# Altium project Carrier_Board.PrjPcb (part 2 of 2)

## Sheet Connectors.SchDoc
size A3; SheetNumber: 3; SheetTotal: 9
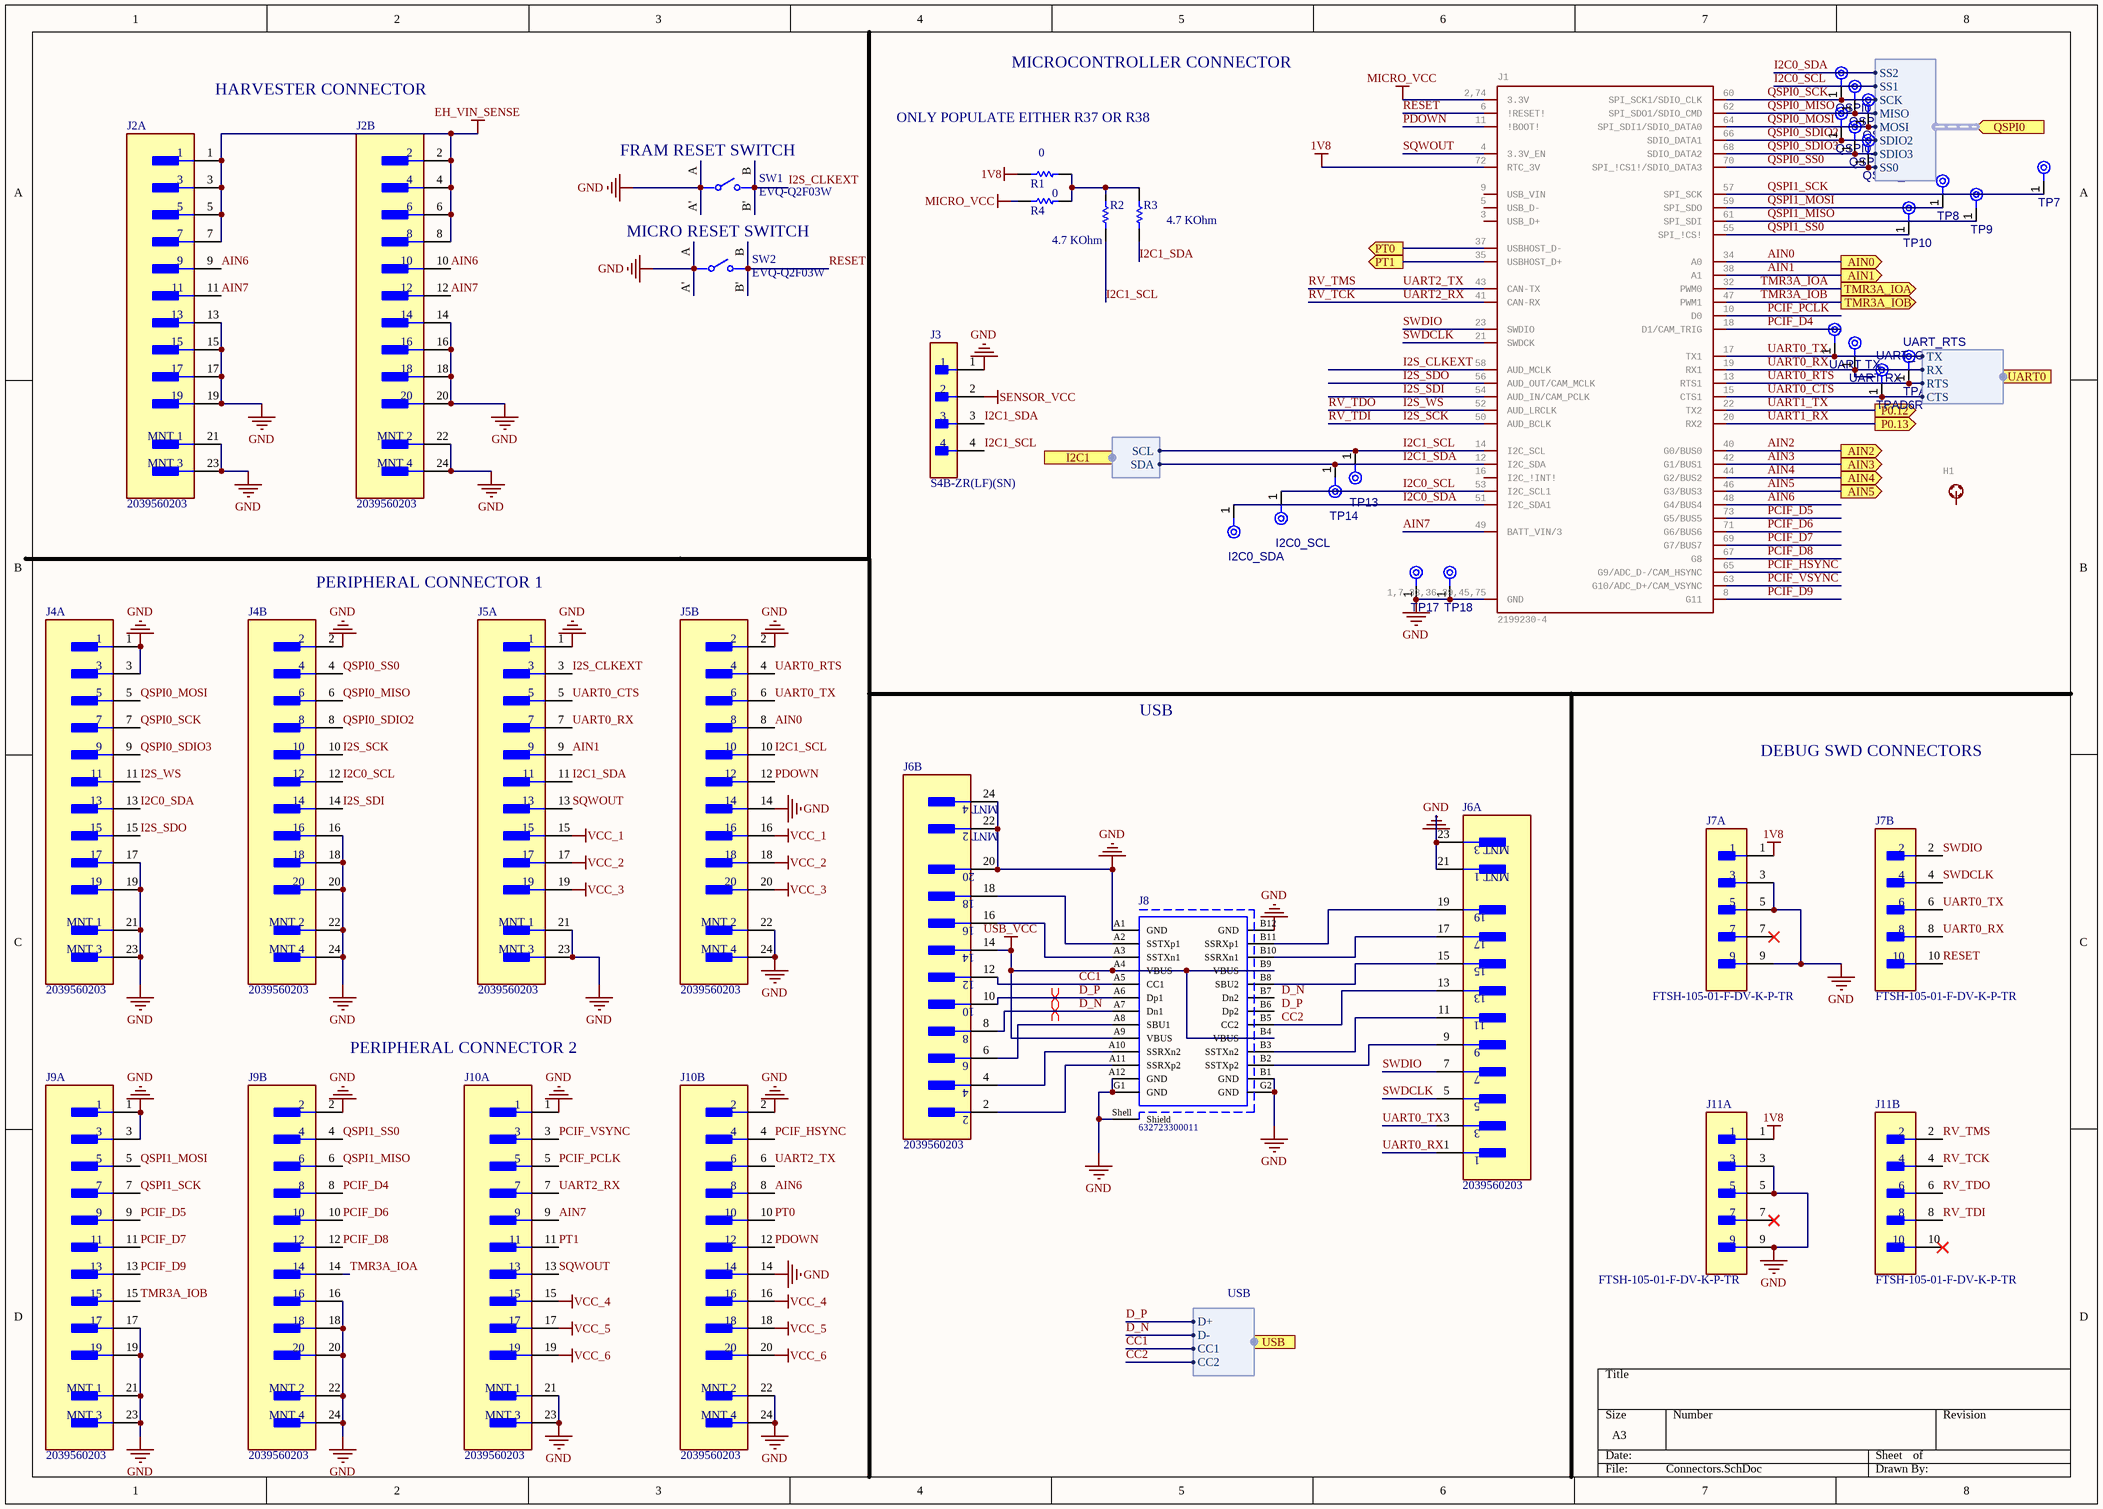
[diagram p4: Connectors.SchDoc]

### Parts
H1  9774025151R  [STAND-OFF-REFLOW-M2-5]  (value not drawn)
I2C0_SCL  TPAD6R  [TP06R]  (value not drawn)  (no BOM)
I2C0_SDA  TPAD6R  [TP06R]  (value not drawn)  (no BOM)
J1  2199230-4  [M-2-CONNECTOR-E]
J2  2039560203  [Molex_0_MFG]  (parts A,B of 2)
J3  S4B-ZR(LF)(SN)  [FP-S4B-ZR_LF_SN-MFG]
J4  2039560203  [Molex_0_MFG]  (parts A,B of 2)
J5  2039560203  [Molex_0_MFG]  (parts A,B of 2)
J6  2039560203  [Molex_0_MFG]  (parts A,B of 2)
J7  FTSH-105-01-F-DV-K-P-TR  [FP-FTSH-105-01-F-DV-K-P-T-MFG]  (parts A,B of 2)
J8  632723300011  [632723300011]
J9  2039560203  [Molex_0_MFG]  (parts A,B of 2)
J10  2039560203  [Molex_0_MFG]  (parts A,B of 2)
J11  FTSH-105-01-F-DV-K-P-TR  [FP-FTSH-105-01-F-DV-K-P-T-MFG]  (parts A,B of 2)
QSPI0_MISO  TPAD6R  [TP06R]  (value not drawn)  (no BOM)
QSPI0_MOSI  TPAD6R  [TP06R]  (value not drawn)  (no BOM)
QSPI0_SCK  TPAD6R  [TP06R]  (value not drawn)  (no BOM)
QSPI0_SDIO2  TPAD6R  [TP06R]  (value not drawn)  (no BOM)
QSPI0_SDIO3  TPAD6R  [TP06R]  (value not drawn)  (no BOM)
QSPI0_SS0  TPAD6R  [TP06R]  (value not drawn)  (no BOM)
R1  Resistance: 0  [RESC1005X40X25NL05T10]  (hidden comment: RC0402JR-070RL)
R2  Resistance: 4.7 KOhm  [RESC1005X40X25ML05T05]  (hidden comment: RMCF0402JT4K70)
R3  Resistance: 4.7 KOhm  [RESC1005X40X25ML05T05]  (hidden comment: RMCF0402JT4K70)
R4  Resistance: 0  [RESC1005X40X25NL05T10]  (hidden comment: RC0402JR-070RL)
SW1  EVQ-Q2F03W  [FP-EVQ-Q2F03W-MFG]
SW2  EVQ-Q2F03W  [FP-EVQ-Q2F03W-MFG]
TP7  TPAD6R  [TP06R]  (value not drawn)  (no BOM)
TP8  TPAD6R  [TP06R]  (value not drawn)  (no BOM)
TP9  TPAD6R  [TP06R]  (value not drawn)  (no BOM)
TP10  TPAD6R  [TP06R]  (value not drawn)  (no BOM)
TP13  TPAD6R  [TP06R]  (value not drawn)  (no BOM)
TP14  TPAD6R  [TP06R]  (value not drawn)  (no BOM)
TP17  TPAD6R  [TP06R]  (value not drawn)  (no BOM)
TP18  TPAD6R  [TP06R]  (value not drawn)  (no BOM)
UART_CTS  TPAD6R  [TP06R]  (no BOM)
UART_RTS  TPAD6R  [TP06R]  (no BOM)
UART_RX  TPAD6R  [TP06R]  (value not drawn)  (no BOM)
UART_TX  TPAD6R  [TP06R]  (value not drawn)  (no BOM)

### Ports
AIN0 (out), AIN1 (out), AIN2 (out), AIN3 (out), AIN4 (out), AIN5 (out), I2C1 (in, harness I2C1), P0.12 (out), P0.13 (out), PT0 (out), PT1 (out), QSPI0 (in, harness QSPI0), TMR3A_IOA (out), TMR3A_IOB (out), UART0 (out, harness *), USB (out, harness USB)

### Harnesses
QSPI0: SCK, MISO, MOSI, SDIO2, SDIO3, SS0, SS1, SS2
I2C1: SCL, SDA
*: TX, RX, RTS, CTS
USB: D+, D-, CC1, CC2

### Nets
1V8: J1.72(RTC_3V) J7.1 J11.1 R1.1
EH_VIN_SENSE: J2.1 J2.2 J2.3 J2.4 J2.5 J2.6 J2.7 J2.8
GND: J1.1,7,33,36,39,45,75(GND) J2.13 J2.14 J2.15 J2.16 J2.17 J2.18 J2.19 J2.20 J2.21(MNT_1) J2.22(MNT_2) J2.23(MNT_3) J2.24(MNT_4) J3.1 J4.1 J4.2 J4.3 J4.16 J4.17 J4.18 J4.19 J4.20 J4.21(MNT_1) J4.22(MNT_2) J4.23(MNT_3) J4.24(MNT_4) J5.1 J5.2 J5.14 J5.21(MNT_1) J5.22(MNT_2) J5.23(MNT_3) J5.24(MNT_4) J6.20 J6.21(MNT_1) J6.22(MNT_2) J6.23(MNT_3) J6.24(MNT_4) J7.3 J7.5 J7.9 J8.A1(GND) J8.A12(GND) J8.B1(GND) J8.B12(GND) J8.G1(GND) J8.G2(GND) J8.Shell(Shield) J9.1 J9.2 J9.3 J9.16 J9.17 J9.18 J9.19 J9.20 J9.21(MNT_1) J9.22(MNT_2) J9.23(MNT_3) J9.24(MNT_4) J10.1 J10.2 J10.14 J10.21(MNT_1) J10.22(MNT_2) J10.23(MNT_3) J10.24(MNT_4) J11.3 J11.5 J11.9 SW1.A SW1.A' SW2.A SW2.A' TP17.1(TP) TP18.1(TP)
MICRO_VCC: J1.2,74(3.3V) R4.1
SENSOR_VCC: J3.2
USB_VCC: J6.14 J8.A4(VBUS) J8.A9(VBUS) J8.B4(VBUS) J8.B9(VBUS)
VCC_1: J5.15 J5.16
VCC_2: J5.17 J5.18
VCC_3: J5.19 J5.20
VCC_4: J10.15 J10.16
VCC_5: J10.17 J10.18
VCC_6: J10.19 J10.20
AIN0: J1.34(A0) J5.8 ; port AIN0
AIN1: J1.38(A1) J5.9 ; port AIN1
AIN2: J1.40(G0/BUS0) ; port AIN2  [project net ADC0]
AIN3: J1.42(G1/BUS1) ; port AIN3  [project net ADC1]
AIN4: J1.44(G2/BUS2) ; port AIN4  [project net ADC2]
AIN5: J1.46(G3/BUS3) ; port AIN5
AIN6: J1.48(G4/BUS4) J2.9 J2.10 J10.8
AIN7: J1.49(BATT_VIN/3) J2.11 J2.12 J10.9
CC1: J6.12 J8.A5(CC1) ; port USB.CC1
CC2: J6.13 J8.B5(CC2) ; port USB.CC2
D_N: J6.8 J8.A7(Dn1) ; port USB.D-
D_P: J6.10 J8.A6(Dp1) ; port USB.D+
I2C0_SCL: I2C0_SCL.1(TP) J1.53(I2C_SCL1) J4.12 ; port QSPI0.SS1
I2C0_SDA: I2C0_SDA.1(TP) J1.51(I2C_SDA1) J4.13 ; port QSPI0.SS2
I2C1_SCL: J1.14(I2C_SCL) J3.4 J5.10 R2.1 TP13.1(TP) ; port I2C1.SCL
I2C1_SDA: J1.12(I2C_SDA) J3.3 J5.11 R3.1 TP14.1(TP) ; port I2C1.SDA
I2S_CLKEXT: J1.58(AUD_MCLK) J5.3 SW1.B SW1.B'
I2S_SCK: J1.50(AUD_BCLK) J4.10 J11.8  [also labelled RV_TDI]
I2S_SDI: J1.54(AUD_IN/CAM_PCLK) J4.14
I2S_SDO: J1.56(AUD_OUT/CAM_MCLK) J4.15
I2S_WS: J1.52(AUD_LRCLK) J4.11 J11.6  [also labelled RV_TDO]
PCIF_D4: J1.18(D1/CAM_TRIG) J9.8
PCIF_D5: J1.73(G5/BUS5) J9.9
PCIF_D6: J1.71(G6/BUS6) J9.10
PCIF_D7: J1.69(G7/BUS7) J9.11
PCIF_D8: J1.67(G8) J9.12
PCIF_D9: J1.8(G11) J9.13
PCIF_HSYNC: J1.65(G9/ADC_D-/CAM_HSYNC) J10.4
PCIF_PCLK: J1.10(D0) J10.5
PCIF_VSYNC: J1.63(G10/ADC_D+/CAM_VSYNC) J10.3
PDOWN: J1.11(!BOOT!) J5.12 J10.12
PT0: J10.10
PT1: J10.11
QSPI0_MISO: J1.62(SPI_SDO1/SDIO_CMD) J4.6 QSPI0_MISO.1(TP) ; port QSPI0.MISO
QSPI0_MOSI: J1.64(SPI_SDI1/SDIO_DATA0) J4.5 QSPI0_MOSI.1(TP) ; port QSPI0.MOSI
QSPI0_SCK: J1.60(SPI_SCK1/SDIO_CLK) J4.7 QSPI0_SCK.1(TP) ; port QSPI0.SCK
QSPI0_SDIO2: J1.66(SDIO_DATA1) J4.8 QSPI0_SDIO2.1(TP) ; port QSPI0.SDIO2
QSPI0_SDIO3: J1.68(SDIO_DATA2) J4.9 QSPI0_SDIO3.1(TP) ; port QSPI0.SDIO3
QSPI0_SS0: J1.70(SPI_!CS1!/SDIO_DATA3) J4.4 QSPI0_SS0.1(TP) ; port QSPI0.SS0
QSPI1_MISO: J1.61(SPI_SDI) J9.6 TP9.1(TP)
QSPI1_MOSI: J1.59(SPI_SDO) J9.5 TP8.1(TP)
QSPI1_SCK: J1.57(SPI_SCK) J9.7 TP7.1(TP)
QSPI1_SS0: J1.55(SPI_!CS!) J9.4 TP10.1(TP)
RCLK: J1.35(USBHOST_D+) ; port PT1
RESET: J1.6(!RESET!) J7.10 SW2.B SW2.B'
RV_TCK: J1.41(CAN-RX) J10.7 J11.4  [also labelled UART2_RX]
RV_TMS: J1.43(CAN-TX) J10.6 J11.2  [also labelled UART2_TX]
SQWOUT: J1.4(3.3V_EN) J5.13 J10.13
SRCLK: J1.37(USBHOST_D-) ; port PT0
SWDCLK: J1.21(SWDCK) J6.5 J7.4
SWDIO: J1.23(SWDIO) J6.7 J7.2
TMR3A_IOA: J1.32(PWM0) J9.14 ; port TMR3A_IOA  [project net CASCADE_EN]
TMR3A_IOB: J1.47(PWM1) J9.15 ; port TMR3A_IOB
UART0_CTS: J1.15(CTS1) J5.5 UART_CTS.1(TP) ; port UART0.CTS
UART0_RTS: J1.13(RTS1) J5.4 UART_RTS.1(TP) ; port UART0.RTS
UART0_RX: J1.19(RX1) J5.7 J6.1 J7.8 UART_RX.1(TP) ; port UART0.RX
UART0_TX: J1.17(TX1) J5.6 J6.3 J7.6 UART_TX.1(TP) ; port UART0.TX
UART1_RX: J1.20(RX2) ; port P0.13  [project net CLK]
UART1_TX: J1.22(TX2) ; port P0.12  [project net SHIFT_DATA]
NetJ6_2: J6.2 J8.A11(SSRXp2)
NetJ6_4: J6.4 J8.A10(SSRXn2)
NetJ6_6: J6.6 J8.A8(SBU1)
NetJ6_9: J6.9 J8.B2(SSTXp2)
NetJ6_11: J6.11 J8.B3(SSTXn2)
NetJ6_15: J6.15 J8.B8(SBU2)
NetJ6_16: J6.16 J8.A3(SSTXn1)
NetJ6_17: J6.17 J8.B10(SSRXn1)
NetJ6_18: J6.18 J8.A2(SSTXp1)
NetJ6_19: J6.19 J8.B11(SSRXp1)
NetR1_2: R1.2 R2.2 R3.2 R4.2

Not connected (* = marked no-connect by the designer): H1 1; J1 3(USB_D+) 5(USB_D-) 9(USB_VIN) 16(I2C_!INT!); J7 7*; J8 B6(Dp2) B7(Dn2); J11 7* 10*

### Layout directives
differential pair: D_N, D_P

### Notes on the sheet
- HARVESTER CONNECTOR
- MICROCONTROLLER CONNECTOR
- (near SW1) FRAM RESET SWITCH
- ONLY POPULATE EITHER R37 OR R38
- MICRO RESET SWITCH
- PERIPHERAL CONNECTOR 1
- USB
- DEBUG SWD CONNECTORS
- PERIPHERAL CONNECTOR 2
- Labels drawn without touching a wire or pin: D_N, D_P

### Library data of the parts
H1 = STAND-OFF-REFLOW2.5MM_TALL: GateName_1: G$1; PROD_ID: HW-14899; SymbolName_1: STAND-OFF-REFLOW; DeviceName: 2.5MM_TALL; LibraryName: SparkFun-Hardware; DeviceSetName: STAND-OFF-REFLOW; Package: STAND-OFF-REFLOW-M2.5
I2C0_SCL I2C0_SDA QSPI0_MISO QSPI0_MOSI QSPI0_SCK QSPI0_SDIO2 QSPI0_SDIO3 QSPI0_SS0 TP7-TP10 TP13 TP14 TP17 TP18 UART_CTS UART_RTS UART_RX UART_TX = CMP-00028-00002-2: 0.6mm round; Pins: 1
J1 = MICROMOD-2222-C: GateName_1: J1; PROD_ID: CONN-14877; SymbolName_1: MICROMOD; DeviceName: -2222-C; LibraryName: SparkFun-MicroMod; DeviceSetName: MICROMOD; Package: M.2-CONNECTOR-E
J2 J4-J6 J9 J10 = CMP-003-000000-1: 20 Position Connector Plug, Outer Shroud Contacts Surface Mount Gold; Manufacturer: Molex; Number Of Contacts: 20; Voltage Rating: 40V; Is Female: no; Symbol Hash: db22f1623fbfed54a22177e49599976dea34d6b12f98f445fc170047d3fb1d12; Conn Gender: Male; Verification Version: 0.0.0.3; Pitch: 0.4mm; Conn Orientation: Vertical; Current Rating: 0.3A; RoHS: TRUE; Digikey Description: CONN PLUG 20POS SMD GOLD; Automotive: No; Temperature Range High: +125°C; Temperature: -40°C to +125°C; Digikey Part Number: 900-2039560203CT-ND; Part Number: 2039560203; Footprint Url: https://www.molex.com/pdm_docs/sd/2039560203_sd.pdf; Lead Free: Yes; ComponentLink1URL: https://upverter.com/part/id/0a58283e91808ac4/; ComponentLink2URL: https://www.molex.com/webdocs/datasheets/pdf/en-us/2039560203_PCB_HEADERS.pdf; Contact Material: Gold,Nickel; Package: 0; Mouser Part Number: 538-203956-0203; Height: 4.55mm; Datasheet Path: datasheets/Conn_Molex_2039560203_eec.pdf; Number Of Rows: 2; ComponentLink1Description: Upverter; Temperature Range Low: -40°C; helpURL: https://upverter.com/part/id/0a58283e91808ac4/; ComponentLink2Description: Datasheet
J3 = CMP-17439-000004-1: CONN HEADER R/A 4POS 1.5MM; Manufacturer: JST; Conn Gender: Male; Conn Orientation: Right Angle; Number Of Contacts: 4; Voltage Rating: 50V; Current Rating: 1A; Device Class L3: unset; Number Of Rows: 1; Category: Conn; ComponentLink2URL: http://www.jst-mfg.com/product/pdf/eng/eZH.pdf; Height: 3.7mm; Pitch: 1.5mm; Device Class L1: Connectors; Octopart: https://octopart.com/s4b-zr%28lf%29%28sn%29-jst-248835; Package: S4B-ZR(LF)(SN); Temperature: -25°C to +85°C; Digikey Description: CONN HEADER R/A 4POS 1.5MM; Contact Material: Tin; Manufacturer Part Number: S4B-ZR(LF)(SN); Temperature Range High: +85°C; Automotive: No; Temperature Range Low: -25°C; Lead Free: Yes; RoHS: TRUE; ComponentLink2Description: Datasheet; Device Class L2: Headers and Wire Housings
J7 J11 = CMP-02766-000120-1: CONN HEADER SMD 10POS 1.27MM; Number of Contacts: 10; Row Spacing: 0.05inch; Connector Type: Male Pin; Contact Plating: Gold; Housing Material: Polymer; Length: 6.35mm; Number of Rows: 2; Min Operating Temperature: -55°C; Pitch: 1.27mm; Termination: Solder; Package Quantity: 500; Lead Free: Lead Free; Radiation Hardening: No; Number of Positions: 10; Orientation: Straight; Contact Material: Bronze; Packaging: Tape and Reel; Depth: 5.84mm; Contact Mating Length: 0.12inch; Housing Color: Black; Mount: Surface Mount; Color: Black; Max Operating Temperature: 125°C
J8 = CMP-1502-03214-1: USB 3.1 Type C Receptacle WR-COM, Horizontal, SMT / THT; Manufacturer: Wurth Elektronik; Rated Current: 5A; Contact Resistance: 30mOhm; Working Voltage: 20VDC; Operating Temperature: -40to105degC; Package Reference: 632723300011; Datasheet URL: https://katalog.we-online.de/em/datasheet/632723x00011%282%29.pdf; Manufacturer URL: http://www.we-online.de; Connector Type: USB3.1TypeC; Gender: Receptacle; Part Number: 632723300011; Mounting Technology: SMT/THT; Publisher: WurthElektronik; Packaging: TapeandReel; Orientation: Horizontal
R1 R4 = CMP-1011-00001-2: Manufacturer: Yageo / Phycomp; Part Number: RC0402JR-070RL
R2 R3 = CMP-2002-01154-4: Chip Resistor, 4.7 KOhm, +/- 1%, 0.1 W, -55 to 155 degC, 0402 (1005 Metric), RoHS, Tape and Reel; PartNumber: ERJ-2RKF4701X; Voltage Rating: 50 V; Case\/Package: 0402; Power Rating: 100 mW; Height: 0.35 mm; Mounting Technology: Surface Mount; REACH SVHC: Yes; Max Operating Temperature: 155 degC; ComponentLink1Description: Manufacturer URL; ComponentLink2Description: Datasheet; Pins: 2; PackageReference: 0402; Tolerance: 1%; Case Code (Imperial): 0402; Length: 1 mm; PackageDescription: 2-Pin Surface Mount Device, Body 1 x 0.5 mm; RoHSCompliant: true; Package Quantity: 1; Radiation Hardening: No; DatasheetVersion: 04/2015; Width: 0.5 mm; Case Code (Metric): 1005; Mount: Surface Mount; ComponentLink1URL: http://www.panasonic.com/; Min Operating Temperature: -55 degC; Packaging: Cut Tape; ComponentLink2URL: http://industrial.panasonic.com/cdbs/www-data/pdf/RDA0000/AOA0000C86.pdf
SW1 SW2 = CMP-05618-000127-1: SWITCH TACTILE SPST-NO 0.02A 15V; Body Depth: 6mm; Illumination Type: Non-Illuminated; Mechanical Life: 1000000Cycles; Switch Travel: 0.2mm; Actuator Length: 1.3mm; Max Voltage Rating (AC): 250V; Contact Resistance: 100mR; Operating Force: 1N; Current Rating: 20mA; Switch Function: Off-Mom; Actuator Color: White; Number of Poles: 1; Throw Configuration: SPST; Actuator Type: Standard; Contact Plating: Gold; Lead Free: Lead Free; Package Quantity: 1; Radiation Hardening: No; Depth: 6.6mm; Termination: SMD/SMT; Voltage Rating (AC): 250V; Size: 1.8mm; Thickness: 1.8mm; Height: 3.1mm; Mount: Surface Mount; Contact Current Rating: 20mA; Color: White; Width: 6.5mm; Series: EVQQ2; Max Operating Temperature: 85°C; Min Operating Temperature: -40°C; Packaging: Tape and Reel; Voltage Rating (DC): 15V; RoHS Compliant: Yes; Length: 6mm; Max Voltage Rating (DC): 15V; Max Current Rating: 20mA; Case/Package: SMD/SMT; Orientation: Straight; Electrical Life: 1000000Cycles

## Sheet CHRT.SchDoc
size A3; SheetNumber: 6; SheetTotal: 9
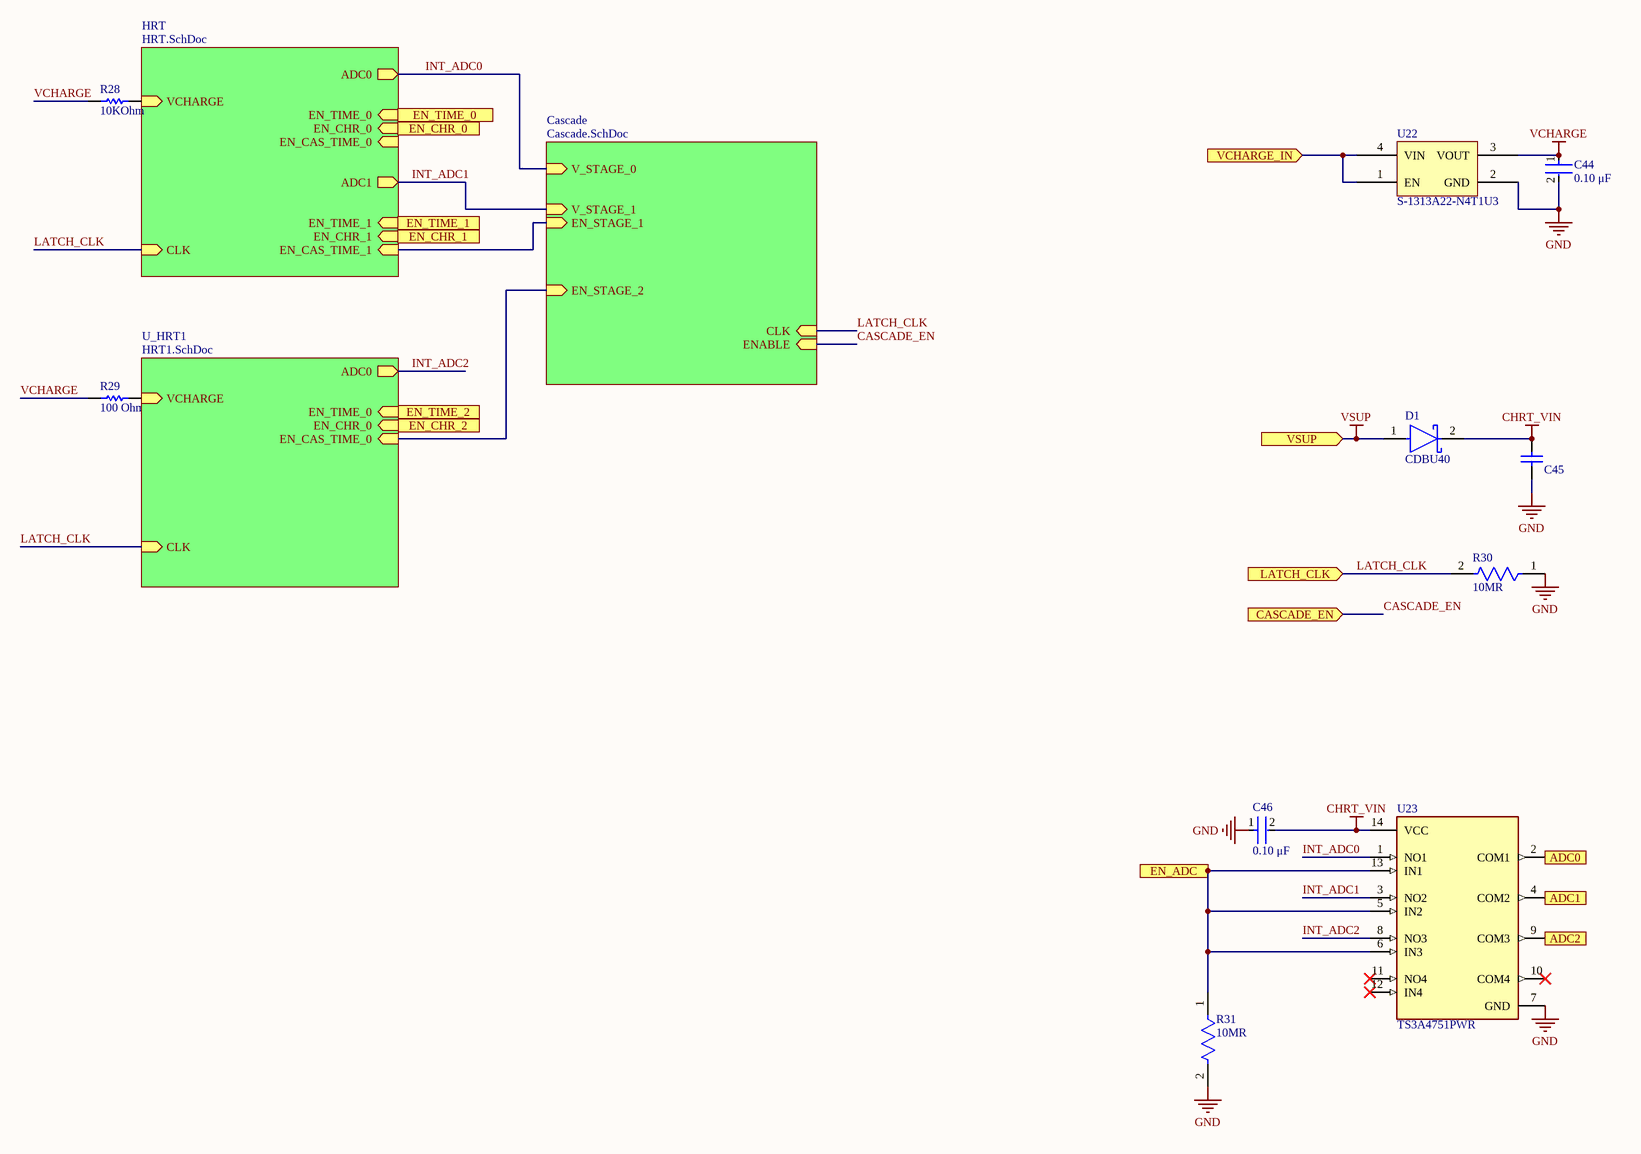
[diagram p5: CHRT.SchDoc]

### Parts
C44  Capacitance: 0.10 μF  [FP-C0402-BB-MFG]  (hidden comment: C0402C104K8PACTU)
C45  ZRB15XR61A106ME01D  [CAPC1005X55X25NL05T10]  (value not drawn)
C46  Capacitance: 0.10 μF  [FP-C0402-BB-MFG]  (hidden comment: C0402C104K8PACTU)
D1  CDBU40  [FP-S8-V-3880_02-001-MFG]
R28  Resistance: 10KOhm  [RESC1005X40X25LL05T05]  (hidden comment: RMCF0402FT10K0)
R29  Resistance: 100 Ohm  [RESC1005X40X25LL05T05]  (hidden comment: ERJ-2RKF1000X)
R30  Resistance: 10MR  [FP-CRCW0402-e3-IPC_C]  (hidden comment: CRCW040210M0JNED)
R31  Resistance: 10MR  [FP-CRCW0402-e3-IPC_C]  (hidden comment: CRCW040210M0JNED)
U22  S-1313A22-N4T1U3  [SOT130P210X110-4N]
U23  TS3A4751PWR  [FP-PW0014A-IPC_C]

### Sub-sheets
Cascade = Cascade.SchDoc: V_STAGE_0 (in), V_STAGE_1 (in), EN_STAGE_1 (in), EN_STAGE_2 (in), CLK (in), ENABLE (in)
HRT = HRT.SchDoc: VCHARGE (in), CLK (in), ADC0 (out), EN_TIME_0 (in), EN_CHR_0 (in), EN_CAS_TIME_0 (in), ADC1 (out), EN_TIME_1 (in), EN_CHR_1 (in), EN_CAS_TIME_1 (in)
U_HRT1 = HRT1.SchDoc: VCHARGE (in), CLK (in), ADC0 (out), EN_TIME_0 (in), EN_CHR_0 (in), EN_CAS_TIME_0 (in)

### Ports
ADC0 (in), ADC1 (in), ADC2 (in), CASCADE_EN (in), EN_ADC (in), EN_CHR_0 (in), EN_CHR_1 (in), EN_CHR_2 (in), EN_TIME_0 (in), EN_TIME_1 (in), EN_TIME_2 (in), LATCH_CLK (in), VCHARGE_IN (in), VSUP (in)

### Nets
CHRT_VIN: C45.2 C46.2 D1.2(C) U23.14(VCC)
EH_VIN: U22.1(EN) U22.4(VIN) ; port VCHARGE_IN
GND: C44.2 C45.1 C46.1 R30.1 R31.2 U22.2(GND) U23.7(GND)
VCHARGE: C44.1 R28.1 R29.1 U22.3(VOUT)
VSUP: D1.1(A) ; port VSUP  [project net MICRO_VCC]
ADC0: U23.2(COM1) ; port ADC0
ADC1: U23.4(COM2) ; port ADC1
ADC2: U23.9(COM3) ; port ADC2
CASCADE_EN: port CASCADE_EN, sheet Cascade/ENABLE
INT_ADC0: U23.1(NO1) ; sheet HRT/ADC0, sheet Cascade/V_STAGE_0
INT_ADC1: U23.3(NO2) ; sheet HRT/ADC1, sheet Cascade/V_STAGE_1
INT_ADC2: U23.8(NO3) ; sheet U_HRT1/ADC0
LATCH_CLK: R30.2 ; port LATCH_CLK, sheet HRT/CLK, sheet Cascade/CLK, sheet U_HRT1/CLK  [project net CLK]
TMR3A_IOB: R31.1 U23.5(IN2) U23.6(IN3) U23.13(IN1) ; port EN_ADC
NetD2_1: R28.2 ; sheet HRT/VCHARGE
NetD3_1: R29.2 ; sheet U_HRT1/VCHARGE
NetR32_2: port EN_CHR_1, sheet HRT/EN_CHR_1
NetR33_2: port EN_CHR_0, sheet HRT/EN_CHR_0
NetR37_2: sheet HRT/EN_CAS_TIME_1, sheet Cascade/EN_STAGE_1
NetR42_2: port EN_CHR_2, sheet U_HRT1/EN_CHR_0
NetR43_2: sheet Cascade/EN_STAGE_2, sheet U_HRT1/EN_CAS_TIME_0
NetU20_2: port EN_TIME_1, sheet HRT/EN_TIME_1
NetU20_5: port EN_TIME_2, sheet U_HRT1/EN_TIME_0
NetU20_15: port EN_TIME_0, sheet HRT/EN_TIME_0

Not connected (* = marked no-connect by the designer): U23 10(COM4)* 11(NO4)* 12(IN4)*

### Library data of the parts
C44 C46 = CMP-2008-02046-2: CAP CER 0.1UF 10V X5R 0402; Manufacturer: Kemet; Material: Ceramic; Temperature Coefficient: 15%; Tolerance: 0.1; Value: 0.10 μF; Package: C0402-BB; Temperature: -55°C to +125°C; ComponentLink2Description: Datasheet; Temperature Characteristic: X5R; Device Class L1: Passive Components; Height: 0.55mm; Lead Free: Yes; ComponentLink2URL: https://content.kemet.com/datasheets/KEM_C1002_X7R_SMD.pdf; Device Class L2: Capacitors; Temperature Range Low: -55°C; Temperature Range High: +125°C; RoHS: TRUE; Octopart: https://octopart.com/c0402c104k8pactu-kemet-140039; Automotive: No; Mouser Description: Capacitor 100 nF 10 VDC 0402; Category: Cap; Voltage Rating: 10 V; Digikey Description: CAP CER 0.1UF 10V X5R 0402; Ipc Land Pattern Name: CAPC10050X50; Device Class L3: Ceramic Capacitors; Manufacturer Part Number: C0402C104K8PACTU
C45 = CMP-2008-04012-1: Manufacturer: Murata; Part Number: GRM155R60G106ME44D; Capacitance: 10uF
D1 = CMP-02539-000026-1: DIODE SCHOTTKY 40V 120MA SOD523; Manufacturer: Vishay; Manufacturer Part Number: BAS40-02V-V-G-08; Max Surge Forward Current: 600mA; Max Junction Temp: +125°C; Peak Reverse Current: 0.02uA; Capacitance: 4pF; Value: 4pF; Temperature: to +125°C; Octopart: https://octopart.com/bas40-02v-v-g-08-vishay-44351221; Device Class L3: Schottky Diodes; RoHS: TRUE; Category: Diode; Digikey Description: DIODE SCHOTTKY 40V 120MA SOD523; Forward Current: 120mA; Automotive: No; Mouser Description: BAS40 Series 40 V 120 mA Surface Mount Small Signal Schottky Diode - SOD-523; Package: S8-V-3880.02-001; Device Class L2: Diodes; ComponentLink2URL: https://www.vishay.com/docs/82391/bas4002v.pdf; Temperature Range High: +125°C; Lead Free: Yes; Reverse Voltage: 40V; ComponentLink2Description: Datasheet; Height: 0.7mm; Max Repetitive Reverse Voltage: 40V; Device Class L1: Discrete Semiconductors
R28 = CMP-2000-07588-1: Chip Resistor, 10 KOhm, +/- 1%, 0.1 W, -55 to 155 degC, 0402 (1005 Metric), RoHS, Tape and Reel; Manufacturer: Panasonic; Power Rating: 100mW; Voltage Rating: 50V; Case\/Package: 0402; Temperature Coefficient: 100ppm\/degreesC; RoHSCompliant: True; Lead Free: LeadFree; Package Quantity: 1; Contact Plating: Tin; Length: 1mm; Radiation Hardening: No; REACH SVHC: NoSVHC; Max Operating Temperature: 155degC; Depth: 0.5mm; Case Code (Imperial): 0402; Military Standard: Not; Package Description: 2-Pin Surface Mount Device, Body 1 x 0.5 mm; Termination: SMD/SMT; Case Code (Metric): 1005; Height: 0.35mm; Packaging: TapeandReel; Voltage Rating (DC): 50V; Package Reference: 402; Number of Pins: 2; Tolerance: 1%; Mounting Technology: SurfaceMount; Width: 0.02inch; Mount: SurfaceMount; Datasheet URL: https://industrial.panasonic.com/cdbs/www-data/pdf/RDA0000/AOA0000C304.pdf; Composition: ThickFilm; Datasheet Version: 02/2017; Manufacturer URL: http://www.panasonic.com/; Max Power Dissipation: 100mW; Number of Terminations: 2; Min Operating Temperature: -55degC
R29 = CMP-2002-00605-3: Chip Resistor, 100 Ohm, +/- 1%, 100 mW, -55 to 155 degC, 0402 (1005 Metric), RoHS, Tape and Reel; Manufacturer: Basic Passives; Power Rating: 100 mW; Voltage Rating: 50 V; Case\/Package: 0402; Width: 0.5 mm; Pins: 2; ComponentLink2Description: Datasheet; PackageReference: 0402; Height: 0.35 mm; Tolerance: 1%; DatasheetVersion: 04/2015; Case Code (Imperial): 0402; Min Operating Temperature: -55 degC; Radiation Hardening: No; Length: 1 mm; Package Quantity: 10000; PackageDescription: 2-Pin Surface Mount Device, Body 1 x 0.5 mm; Mounting Technology: Surface Mount; Case Code (Metric): 1005; Packaging: Tape and Reel; ComponentLink1URL: http://www.panasonic.com/; RoHSCompliant: true; Max Operating Temperature: 155 degC; REACH SVHC: Yes; PartNumber: ERJ-2RKF1000X; ComponentLink1Description: Manufacturer URL; ComponentLink2URL: http://industrial.panasonic.com/cdbs/www-data/pdf/RDA0000/AOA0000C86.pdf; Mount: Surface Mount
R30 R31 = CMP-1011-00170-3: RES Thick Film, 10MΩ, 5%, 0.063W, 200ppm/°C, 0402; Voltage Rating (DC): 50V; Max Power Dissipation: 63mW; Case Code (Metric): 1005; Tolerance: 5%; Lead Free: Lead Free; Length: 1mm; Packaging: Tape and Reel; Depth: 0.5mm; Composition: Thick Film; Temperature Coefficient: 200ppm/°C; Package Quantity: 1; Radiation Hardening: No; Weight: 2.3E-05oz; Width: 0.5mm; Military Standard: Not; Power Rating: 63mW; Case/Package: 0402; Termination: SMD/SMT; Height: 0.016inch; Voltage Rating: 50V; Contact Plating: Tin; Number of Terminations: 2; Features: Automotive AEC-Q200; Max Operating Temperature: 155°C; Case Code (Imperial): 0402; Min Operating Temperature: -55°C
U23 = CMP-04892-000059-1: IC SWITCH QUAD SPST 14TSSOP; Bandwidth: 125MHz; High Level Output Current: 100mA; Max Supply Voltage: 3.6V; Operating Supply Voltage: 3V; Polarity: Non-Inverting; Turn-Off Delay Time: 9ns; On-State Resistance: 900mR; Supply Type: Single; Max Supply Current: 75nA; Number of Inputs: 4; Turn-On Delay Time: 14ns; Min Supply Voltage: 1.6V; Packaging: Tape and Reel; Contact Plating: Gold; Mount: Surface Mount; Low Level Output Current: 100mA; Termination: SMD/SMT; Min Operating Temperature: -40°C; Case/Package: TSSOP; REACH SVHC: No SVHC; Weight: 0.002018oz; Number of Pins: 14; Throw Configuration: SPST; Height: 1.05mm; Radiation Hardening: No; Length: 5.1mm; Max Operating Temperature: 85°C; Package Quantity: 1; Lead Free: Lead Free; RoHS Compliant: Yes; Number of Channels: 4; Number of Outputs: 4; Width: 4.5mm

## Sheet HRT.SchDoc
size A; SheetNumber: 7; SheetTotal: 9
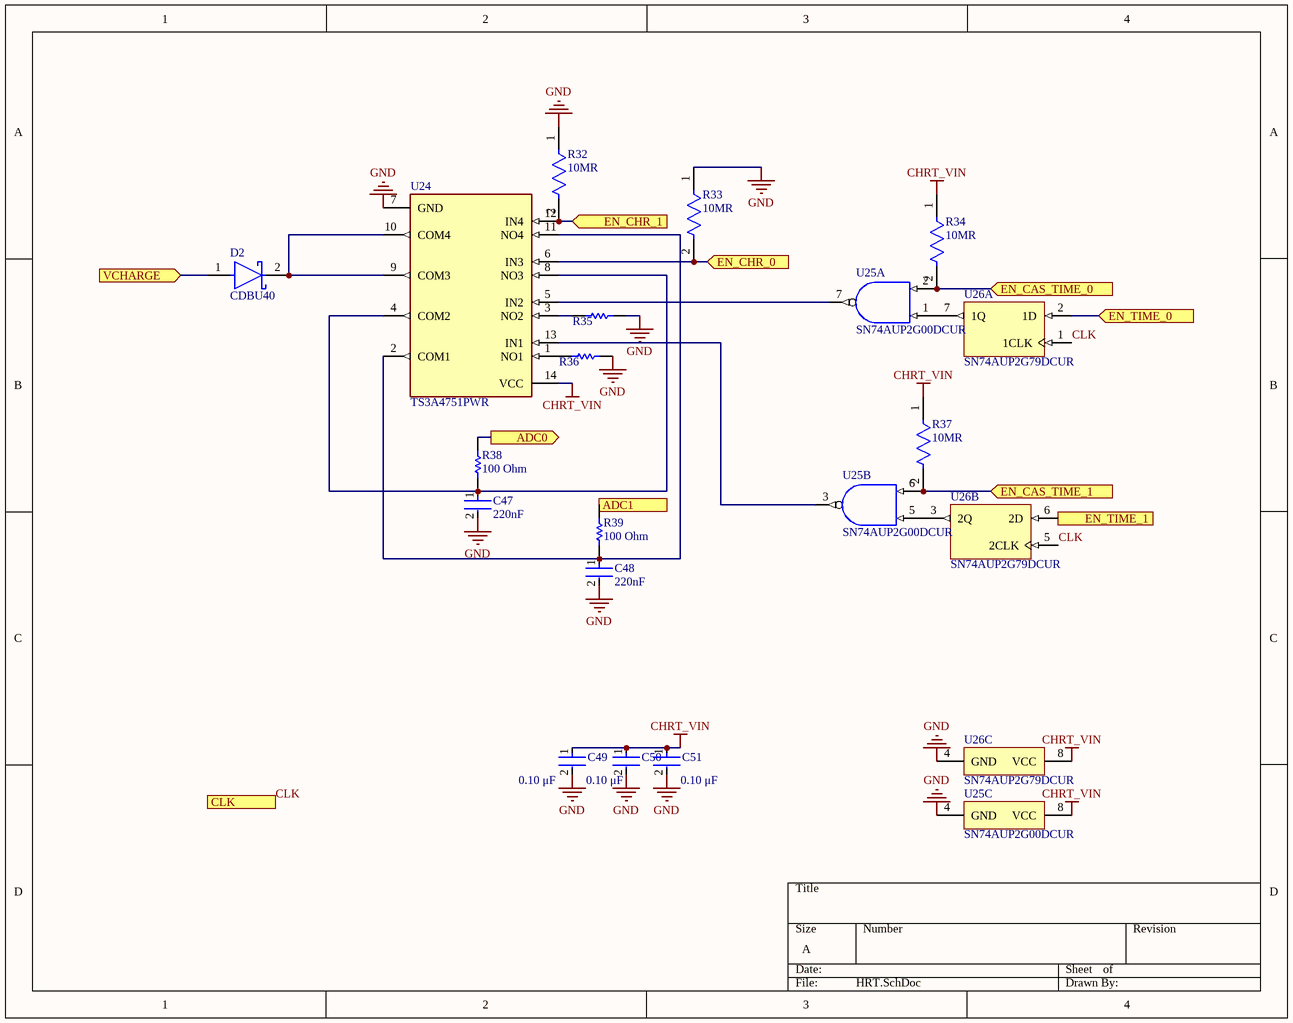
[diagram p6: HRT.SchDoc]

### Parts
C47  Capacitance: 220nF  [FP-GRM155-0_05-IPC_C]  (hidden comment: GRM155R71C224KA12D)
C48  Capacitance: 220nF  [FP-GRM155-0_05-IPC_C]  (hidden comment: GRM155R71C224KA12D)
C49  Capacitance: 0.10 μF  [FP-C0402-BB-MFG]  (hidden comment: C0402C104K8PACTU)
C50  Capacitance: 0.10 μF  [FP-C0402-BB-MFG]  (hidden comment: C0402C104K8PACTU)
C51  Capacitance: 0.10 μF  [FP-C0402-BB-MFG]  (hidden comment: C0402C104K8PACTU)
D2  CDBU40  [FP-S8-V-3880_02-001-MFG]
R32  Resistance: 10MR  [FP-CRCW0402-e3-IPC_C]  (hidden comment: CRCW040210M0JNED)
R33  Resistance: 10MR  [FP-CRCW0402-e3-IPC_C]  (hidden comment: CRCW040210M0JNED)
R34  Resistance: 10MR  [FP-CRCW0402-e3-IPC_C]  (hidden comment: CRCW040210M0JNED)
R35  CRCW040222R0FKED  [RESC1005X40X25LL05T05]  (value not drawn)
R36  CRCW040222R0FKED  [RESC1005X40X25LL05T05]  (value not drawn)
R37  Resistance: 10MR  [FP-CRCW0402-e3-IPC_C]  (hidden comment: CRCW040210M0JNED)
R38  Resistance: 100 Ohm  [RESC1005X40X25LL05T05]  (hidden comment: ERJ-2RKF1000X)
R39  Resistance: 100 Ohm  [RESC1005X40X25LL05T05]  (hidden comment: ERJ-2RKF1000X)
U24  TS3A4751PWR  [FP-PW0014A-IPC_C]
U25  SN74AUP2G00DCUR  [DCU0008A_L]  (parts A,B,C of 3)
U26  SN74AUP2G79DCUR  [DCU0008A_L]  (parts A,B,C of 3)

### Ports
ADC0 (out), ADC1 (out), CLK (in), EN_CAS_TIME_0 (in), EN_CAS_TIME_1 (in), EN_CHR_0 (in), EN_CHR_1 (in), EN_TIME_0 (in), EN_TIME_1 (in), VCHARGE (in)

### Nets
CHRT_VIN: C49.1 C50.1 C51.1 R34.1 R37.1 U24.14(VCC) U25.8(VCC) U26.8(VCC)
GND: C47.2 C48.2 C49.2 C50.2 C51.2 R32.1 R33.1 R35.2 R36.2 U24.7(GND) U25.4(GND) U26.4(GND)
CLK: U26.1(1CLK) U26.5(2CLK) ; port CLK
INT_ADC0: R38.2 ; port ADC0
INT_ADC1: R39.2 ; port ADC1
NetC47_1: C47.1 R38.1 U24.4(COM2) U24.8(NO3)
NetC48_1: C48.1 R39.1 U24.2(COM1) U24.11(NO4)
NetD2_1: D2.1(A) ; port VCHARGE
NetD2_2: D2.2(C) U24.9(COM3) U24.10(COM4)
NetR32_2: R32.2 U24.12(IN4) ; port EN_CHR_1
NetR33_2: R33.2 U24.6(IN3) ; port EN_CHR_0
NetR34_2: R34.2 U25.2(1B) ; port EN_CAS_TIME_0
NetR35_1: R35.1 U24.3(NO2)
NetR36_1: R36.1 U24.1(NO1)
NetR37_2: R37.2 U25.6(2B) ; port EN_CAS_TIME_1
NetU20_2: U26.6(2D) ; port EN_TIME_1
NetU20_15: U26.2(1D) ; port EN_TIME_0
NetU24_5: U24.5(IN2) U25.7(1Y)
NetU24_13: U24.13(IN1) U25.3(2Y)
NetU25_1: U25.1(1A) U26.7(1Q)
NetU25_5: U25.5(2A) U26.3(2Q)

### Library data of the parts
C47 C48 = CMP-1034-02089-3: Chip Multilayer Ceramic Capacitors for General Purpose, 0402, 0.22uF, X7R, 15%, 10%, 16V; Depth: 0.5mm; Dielectric: X7R; Min Operating Temperature: -55°C; Package Quantity: 1; Termination: SMD/SMT; Mount: Surface Mount; Radiation Hardening: No; Height: 0.5mm; Case Code (Metric): 1005; Packaging: Tape and Reel; Material: Ceramic; Voltage: 16V; Voltage Rating (DC): 16V; REACH SVHC: No SVHC; Voltage Rating: 16V; Length: 1mm; Tolerance: 10%; Thickness: 0.022inch; Case Code (Imperial): 0402; Max Operating Temperature: 125°C; Width: 0.02inch; Lead Free: Lead Free; Case/Package: 0402
C49-C51 = CMP-2008-02046-2: as C44 on sheet CHRT; Package: C0402-BB; Temperature: -55°C to +125°C; ComponentLink2Description: Datasheet; Temperature Characteristic: X5R; Device Class L1: Passive Components; Height: 0.55mm; Lead Free: Yes; ComponentLink2URL: https://content.kemet.com/datasheets/KEM_C1002_X7R_SMD.pdf; Device Class L2: Capacitors; Temperature Range Low: -55°C; Temperature Range High: +125°C; RoHS: TRUE; Octopart: https://octopart.com/c0402c104k8pactu-kemet-140039; Automotive: No; Mouser Description: Capacitor 100 nF 10 VDC 0402; Category: Cap; Voltage Rating: 10 V; Digikey Description: CAP CER 0.1UF 10V X5R 0402; Ipc Land Pattern Name: CAPC10050X50; Device Class L3: Ceramic Capacitors; Manufacturer Part Number: C0402C104K8PACTU
D2 = CMP-02539-000026-1: as D1 on sheet CHRT; Temperature: to +125°C; Octopart: https://octopart.com/bas40-02v-v-g-08-vishay-44351221; Device Class L3: Schottky Diodes; RoHS: TRUE; Category: Diode; Digikey Description: DIODE SCHOTTKY 40V 120MA SOD523; Forward Current: 120mA; Automotive: No; Mouser Description: BAS40 Series 40 V 120 mA Surface Mount Small Signal Schottky Diode - SOD-523; Package: S8-V-3880.02-001; Device Class L2: Diodes; ComponentLink2URL: https://www.vishay.com/docs/82391/bas4002v.pdf; Temperature Range High: +125°C; Lead Free: Yes; Reverse Voltage: 40V; ComponentLink2Description: Datasheet; Height: 0.7mm; Max Repetitive Reverse Voltage: 40V; Device Class L1: Discrete Semiconductors
R32-R34 R37 = CMP-1011-00170-3: as R30 on sheet CHRT; Case Code (Metric): 1005; Tolerance: 5%; Lead Free: Lead Free; Length: 1mm; Packaging: Tape and Reel; Depth: 0.5mm; Composition: Thick Film; Temperature Coefficient: 200ppm/°C; Package Quantity: 1; Radiation Hardening: No; Weight: 2.3E-05oz; Width: 0.5mm; Military Standard: Not; Power Rating: 63mW; Case/Package: 0402; Termination: SMD/SMT; Height: 0.016inch; Voltage Rating: 50V; Contact Plating: Tin; Number of Terminations: 2; Features: Automotive AEC-Q200; Max Operating Temperature: 155°C; Case Code (Imperial): 0402; Min Operating Temperature: -55°C
R35 R36 = CMP-2002-08382-1: Manufacturer: Vishay Dale; Part Number: CRCW040222R0FKED
R38 R39 = CMP-2002-00605-3: as R29 on sheet CHRT; Width: 0.5 mm; Pins: 2; ComponentLink2Description: Datasheet; PackageReference: 0402; Height: 0.35 mm; Tolerance: 1%; DatasheetVersion: 04/2015; Case Code (Imperial): 0402; Min Operating Temperature: -55 degC; Radiation Hardening: No; Length: 1 mm; Package Quantity: 10000; PackageDescription: 2-Pin Surface Mount Device, Body 1 x 0.5 mm; Mounting Technology: Surface Mount; Case Code (Metric): 1005; Packaging: Tape and Reel; ComponentLink1URL: http://www.panasonic.com/; RoHSCompliant: true; Max Operating Temperature: 155 degC; REACH SVHC: Yes; PartNumber: ERJ-2RKF1000X; ComponentLink1Description: Manufacturer URL; ComponentLink2URL: http://industrial.panasonic.com/cdbs/www-data/pdf/RDA0000/AOA0000C86.pdf; Mount: Surface Mount
U24 = CMP-04892-000059-1: as U23 on sheet CHRT; Packaging: Tape and Reel; Contact Plating: Gold; Mount: Surface Mount; Low Level Output Current: 100mA; Termination: SMD/SMT; Min Operating Temperature: -40°C; Case/Package: TSSOP; REACH SVHC: No SVHC; Weight: 0.002018oz; Number of Pins: 14; Throw Configuration: SPST; Height: 1.05mm; Radiation Hardening: No; Length: 5.1mm; Max Operating Temperature: 85°C; Package Quantity: 1; Lead Free: Lead Free; RoHS Compliant: Yes; Number of Channels: 4; Number of Outputs: 4; Width: 4.5mm
U25 = CMP-0859-00590-3: Low-Power Dual 2-Input Positive-NAND Gate, DCU0008A, LARGE T&R; Manufacturer: Texas Instruments; tpd @ Nom Voltage(Max)(ns): 31.8,26.3,16.6,12.9,8.8,6.7; 3-State Output: No; Rating: Catalog; Output Type: CMOS; Bits(#): 2; ICC @ Nom Voltage(Max)(mA): 0.0009; Gate Type: NAND; F @ Nom Voltage(Max)(Mhz): 100; Output Drive (IOL/IOH)(Max)(mA): 20/-20; VCC(Min)(V): 0.8; Logic: True; VCC(Max)(V): 3.6; Technology Family: AUP; Voltage(Nom)(V): 0.8,1.2,1.5,1.8,2.5,3.3; Sub-Family: NAND Gate; Generic Part Number: SN74AUP2G00; PackageReference: DCU0008A; Schmitt Trigger: No; Input Type: CMOS; DatasheetVersion: SCES752C; Operating Temperature Range(C): -40 to 85
U26 = CMP-0859-00716-3: Low-Power Dual Positive-Edge-Triggered D-Type Flip-Flop, DCU0008A, LARGE T&R; Manufacturer: Texas Instruments; ICC @ Nom Voltage(Max)(mA): 0.0009; 3-State Output: No; Input Type: CMOS; Rating: Catalog; Output Drive (IOL/IOH)(Max)(mA): 20/-20; VCC(Max)(V): 3.6; Bits(#): 2; Technology Family: AUP; Logic: True; Voltage(Nom)(V): 0.8,1.2,1.5,1.8,2.5,3.3; VCC(Min)(V): 0.8; tpd @ Nom Voltage(Max)(ns): 27.2,17.3,13.3,11.3,7.8,6.3; F @ Nom Voltage(Max)(Mhz): 100; DatasheetVersion: SCES755C; Generic Part Number: SN74AUP2G79; Sub-Family: D-Type Flip-Flop; PackageReference: DCU0008A; Schmitt Trigger: No; Output Type: CMOS; Operating Temperature Range(C): -40 to 85

## Sheet Cascade.SchDoc
size A; SheetNumber: 8; SheetTotal: 9
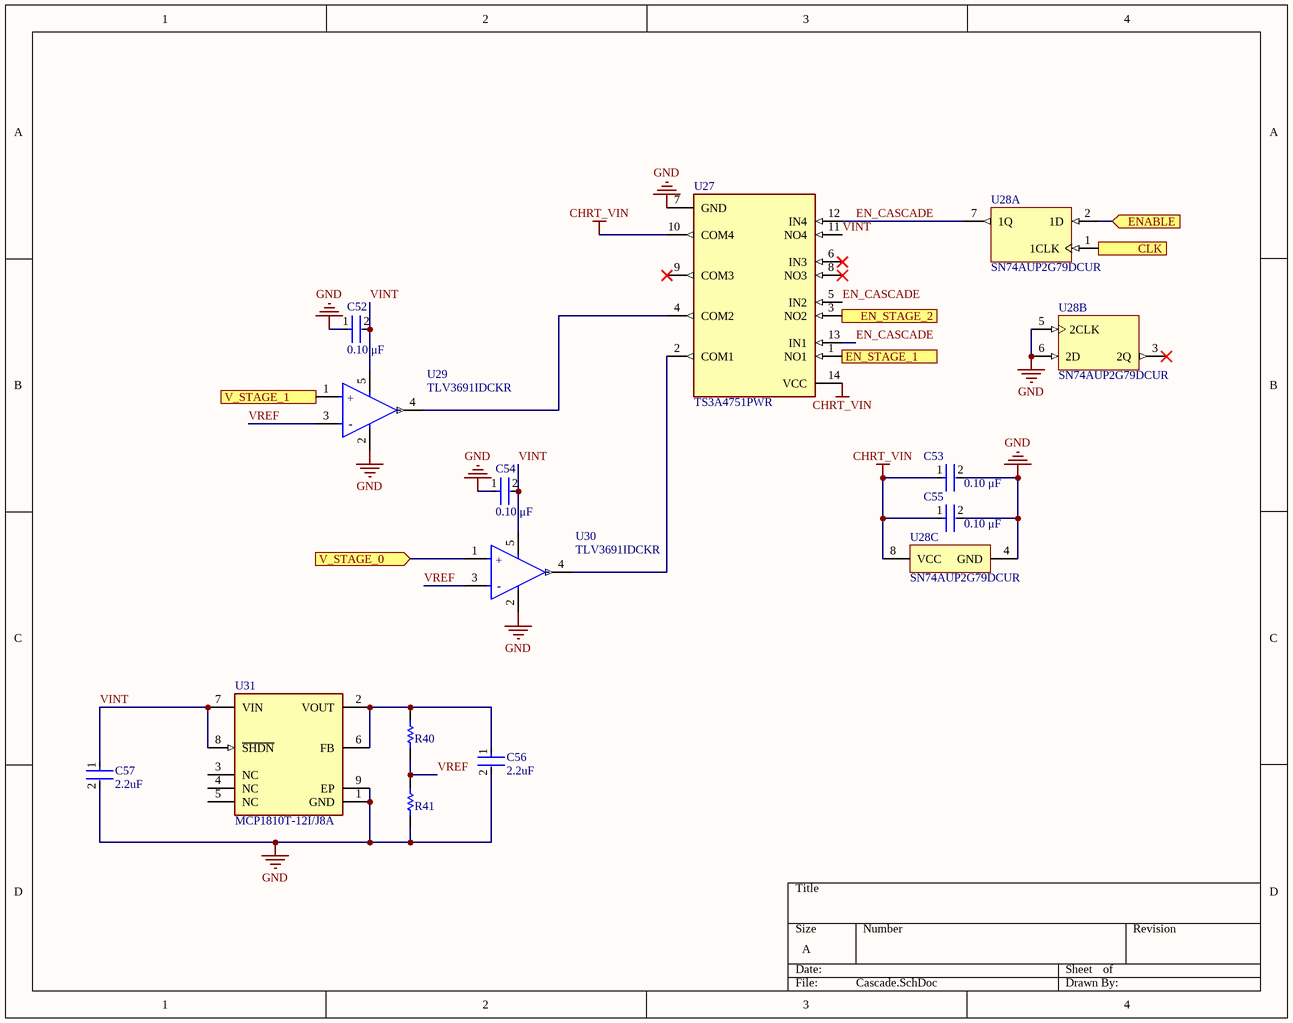
[diagram p7: Cascade.SchDoc]

### Parts
C52  Capacitance: 0.10 μF  [FP-C0402-BB-MFG]  (hidden comment: C0402C104K8PACTU)
C53  Capacitance: 0.10 μF  [FP-C0402-BB-MFG]  (hidden comment: C0402C104K8PACTU)
C54  Capacitance: 0.10 μF  [FP-C0402-BB-MFG]  (hidden comment: C0402C104K8PACTU)
C55  Capacitance: 0.10 μF  [FP-C0402-BB-MFG]  (hidden comment: C0402C104K8PACTU)
C56  Capacitance: 2.2uF  [FP-GRM188-0_1-e0_2_0_5-MFG]  (hidden comment: GRM188R71A225KE15D)
C57  Capacitance: 2.2uF  [FP-GRM188-0_1-e0_2_0_5-MFG]  (hidden comment: GRM188R71A225KE15D)
R40  ERJ-2GEJ915X  [RESC1005X40X25LL05T05]  (value not drawn)
R41  CRCW04022M40FKED  [RESC1005X40X25LL05T05]  (value not drawn)
U27  TS3A4751PWR  [FP-PW0014A-IPC_C]
U28  SN74AUP2G79DCUR  [DCU0008A_L]  (parts A,B,C of 3)
U29  TLV3691IDCKR  [FP-DCK0005A-IPC_A]
U30  TLV3691IDCKR  [FP-DCK0005A-IPC_A]
U31  MCP1810T-12I/J8A  [FP-C04-1207A-MFG]

### Ports
CLK (in), EN_STAGE_1 (in), EN_STAGE_2 (in), ENABLE (in), V_STAGE_0 (in), V_STAGE_1 (in)

### Nets
CHRT_VIN: C53.1 C55.1 U27.10(COM4) U27.14(VCC) U28.8(VCC)
GND: C52.1 C53.2 C54.1 C55.2 C56.2 C57.2 R41.2 U27.7(GND) U28.4(GND) U28.5(2CLK) U28.6(2D) U29.2(GND) U30.2(GND) U31.1(GND) U31.9(EP)
CASCADE_EN: U28.2(1D) ; port ENABLE
CLK: U28.1(1CLK) ; port CLK
EN_CASCADE: U27.5(IN2) U27.12(IN4) U27.13(IN1) U28.7(1Q)
INT_ADC0: U30.1(IN+) ; port V_STAGE_0
INT_ADC1: U29.1(IN+) ; port V_STAGE_1
VINT: C52.2 C54.2 C57.1 U27.11(NO4) U29.5(VCC) U30.5(VCC) U31.7(VIN) U31.8(~{SHDN})
VREF: R40.1 R41.1 U29.3(IN-) U30.3(IN-)
NetC56_1: C56.1 R40.2 U31.2(VOUT) U31.6(FB)
NetR37_2: U27.1(NO1) ; port EN_STAGE_1
NetR43_2: U27.3(NO2) ; port EN_STAGE_2
NetU27_2: U27.2(COM1) U30.4(OUT)
NetU27_4: U27.4(COM2) U29.4(OUT)

Not connected (* = marked no-connect by the designer): U27 6(IN3)* 8(NO3)* 9(COM3)*; U28 3(2Q)*; U31 3(NC) 4(NC) 5(NC)

### Notes on the sheet
- (in symbol CMP-04896-000044-1) +; -

### Library data of the parts
C52-C55 = CMP-2008-02046-2: as C44 on sheet CHRT; Package: C0402-BB; Temperature: -55°C to +125°C; ComponentLink2Description: Datasheet; Temperature Characteristic: X5R; Device Class L1: Passive Components; Height: 0.55mm; Lead Free: Yes; ComponentLink2URL: https://content.kemet.com/datasheets/KEM_C1002_X7R_SMD.pdf; Device Class L2: Capacitors; Temperature Range Low: -55°C; Temperature Range High: +125°C; RoHS: TRUE; Octopart: https://octopart.com/c0402c104k8pactu-kemet-140039; Automotive: No; Mouser Description: Capacitor 100 nF 10 VDC 0402; Category: Cap; Voltage Rating: 10 V; Digikey Description: CAP CER 0.1UF 10V X5R 0402; Ipc Land Pattern Name: CAPC10050X50; Device Class L3: Ceramic Capacitors; Manufacturer Part Number: C0402C104K8PACTU
C56 C57 = CMP-2006-02836-2: Chip Multilayer Ceramic Capacitors for General Purpose, 0603, 2.2uF, X7R, 15%, 10%, 10V; Case Code (Metric): 1608; Height: 0.8mm; Packaging: Cut Tape; Voltage: 10V; Lead Free: Lead Free; Min Operating Temperature: -55°C; Voltage Rating (DC): 10V; Max Operating Temperature: 125°C; Voltage Rating: 10V; Dielectric: X7R; Depth: 0.8mm; Case Code (Imperial): 0603; Termination: SMD/SMT; Case/Package: 0603; Number of Pins: 2; REACH SVHC: No SVHC; Mount: Surface Mount; Width: 0.031inch; Material: Ceramic; Package Quantity: 1; Weight: 7.1E-05oz; Length: 1.6mm; Thickness: 0.035inch; Tolerance: 10%
R40 = CMP-2002-00597-1: Manufacturer: Panasonic; Part Number: ERJ-2GEJ915X
R41 = CMP-1011-00890-2: Manufacturer: Vishay Dale; Part Number: CRCW04022M40FKED
U27 = CMP-04892-000059-1: as U23 on sheet CHRT; Packaging: Tape and Reel; Contact Plating: Gold; Mount: Surface Mount; Low Level Output Current: 100mA; Termination: SMD/SMT; Min Operating Temperature: -40°C; Case/Package: TSSOP; REACH SVHC: No SVHC; Weight: 0.002018oz; Number of Pins: 14; Throw Configuration: SPST; Height: 1.05mm; Radiation Hardening: No; Length: 5.1mm; Max Operating Temperature: 85°C; Package Quantity: 1; Lead Free: Lead Free; RoHS Compliant: Yes; Number of Channels: 4; Number of Outputs: 4; Width: 4.5mm
U28 = CMP-0859-00716-3: as U26 on sheet HRT; DatasheetVersion: SCES755C; Generic Part Number: SN74AUP2G79; Sub-Family: D-Type Flip-Flop; PackageReference: DCU0008A; Schmitt Trigger: No; Output Type: CMOS; Operating Temperature Range(C): -40 to 85
U29 U30 = CMP-04896-000044-1: IC COMPARATOR NANO-POWER SC70-5; Max Supply Voltage: 6.5V; Propagation Delay: 35us; Quiescent Current: 150nA; Max Input Current: 100pA; Min Supply Voltage: 900mV; Number of Elements: 1; Min Dual Supply Voltage: 450mV; Max Dual Supply Voltage: 3.25V; Output Current: 42mA; Input Offset Voltage (Vos): 3mV; Response Time: 24us; Packaging: Tape and Reel; Type: General Purpose; RoHS Compliant: Yes; Number of Pins: 5; Max Operating Temperature: 125°C; Input Bias Current: 100pA; Mount: Surface Mount; Radiation Hardening: No; Contact Plating: Gold; Number of Channels: 1; Min Operating Temperature: -40°C; Package Quantity: 3000; Lead Free: Lead Free; Case/Package: SC
U31 = CMP-06324-000006-1: IC REG LINEAR 1.2V 150MA 8VDFN; Manufacturer: Microchip Technology; Number Of Outputs: 1; Max Junction Temp: +150°C; Dropout Voltage: 380mV; Standoff Height: 0mm; Nominal Supply Current: 0.02uA; Min Supply Voltage: 2.5V; Max Supply Voltage: 5.5V; Output Type: Fixed; Temperature: -40°C to +85°C; Output Voltage: 1.2V; Device Class L1: Integrated Circuits (ICs); Digikey Description: IC REG LINEAR 1.2V 150MA 8VDFN; Automotive: No; Manufacturer Part Number: MCP1810T-12I/J8A; Device Class L3: Voltage Regulators - Linear; Temperature Range Low: -40°C; Package: C04-1207A; Temperature Range High: +85°C; Height: 0.9mm; ComponentLink2Description: Datasheet; Ipc Land Pattern Name: DFN200X200X85-8; Octopart: https://octopart.com/mcp1810t-12i%2Fj8a-microchip-75615047; Device Class L2: Power Management ICs; Lead Free: Yes; Category: IC; ComponentLink2URL: http://ww1.microchip.com/downloads/en/DeviceDoc/20005623B.pdf; RoHS: TRUE; Output Current: 150mA

## Sheet HRT1.SchDoc
size A; SheetNumber: 9; SheetTotal: 9
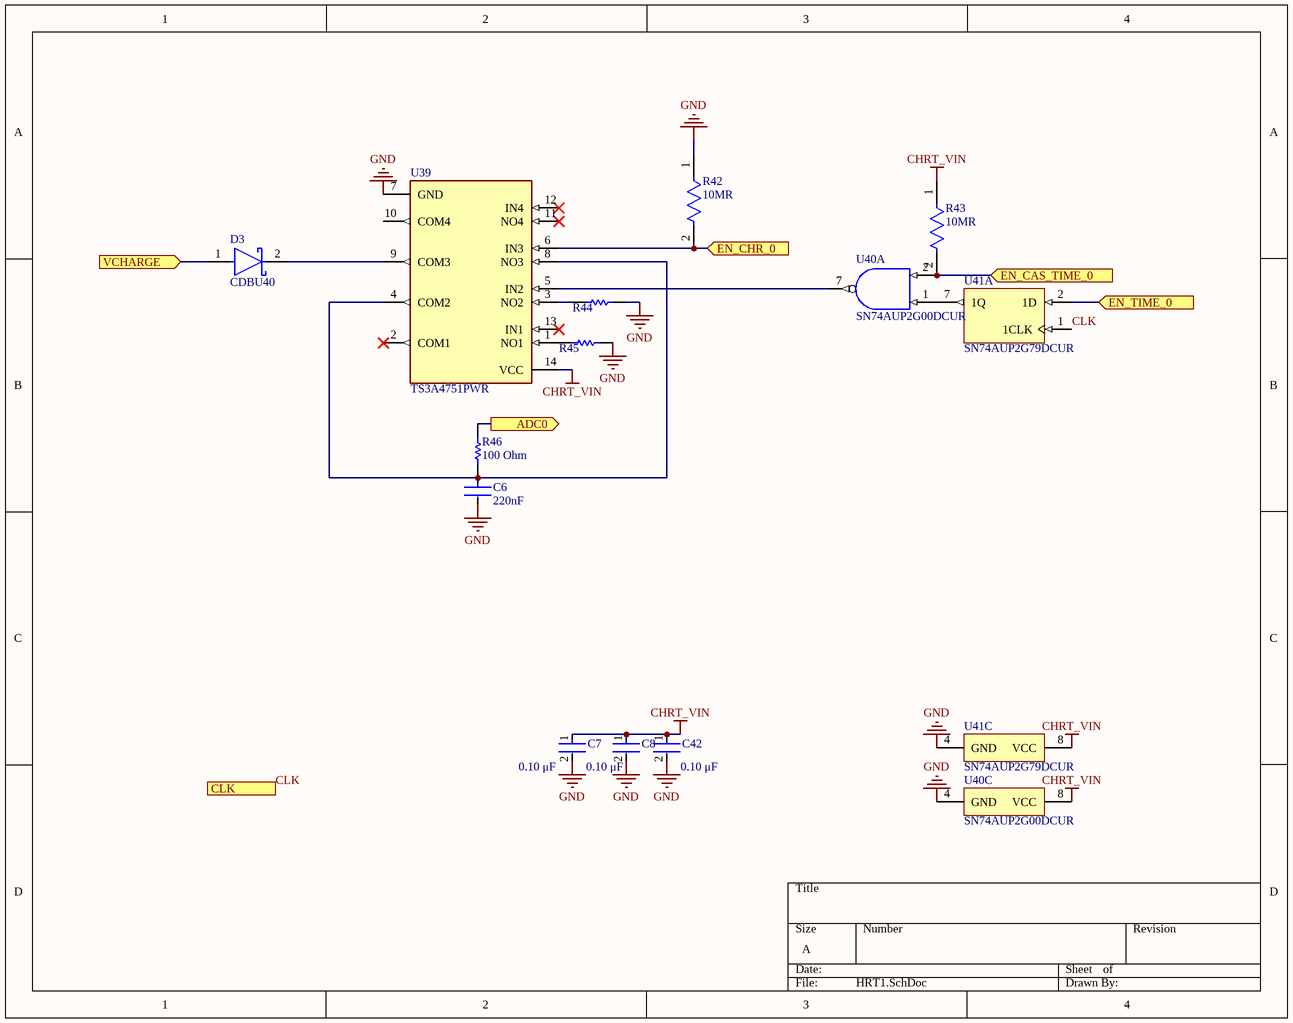
[diagram p8: HRT1.SchDoc]

### Parts
C6  Capacitance: 220nF  [FP-GRM155-0_05-IPC_C]  (hidden comment: GRM155R71C224KA12D)
C7  Capacitance: 0.10 μF  [FP-C0402-BB-MFG]  (hidden comment: C0402C104K8PACTU)
C8  Capacitance: 0.10 μF  [FP-C0402-BB-MFG]  (hidden comment: C0402C104K8PACTU)
C42  Capacitance: 0.10 μF  [FP-C0402-BB-MFG]  (hidden comment: C0402C104K8PACTU)
D3  CDBU40  [FP-S8-V-3880_02-001-MFG]
R42  Resistance: 10MR  [FP-CRCW0402-e3-IPC_C]  (hidden comment: CRCW040210M0JNED)
R43  Resistance: 10MR  [FP-CRCW0402-e3-IPC_C]  (hidden comment: CRCW040210M0JNED)
R44  CRCW040222R0FKED  [RESC1005X40X25LL05T05]  (value not drawn)
R45  CRCW040222R0FKED  [RESC1005X40X25LL05T05]  (value not drawn)
R46  Resistance: 100 Ohm  [RESC1005X40X25LL05T05]  (hidden comment: ERJ-2RKF1000X)
U39  TS3A4751PWR  [FP-PW0014A-IPC_C]
U40  SN74AUP2G00DCUR  [DCU0008A_L]  (parts A,C of 3)
U41  SN74AUP2G79DCUR  [DCU0008A_L]  (parts A,C of 3)

### Ports
ADC0 (out), CLK (in), EN_CAS_TIME_0 (in), EN_CHR_0 (in), EN_TIME_0 (in), VCHARGE (in)

### Nets
CHRT_VIN: C7.1 C8.1 C42.1 R43.1 U39.14(VCC) U40.8(VCC) U41.8(VCC)
GND: C6.2 C7.2 C8.2 C42.2 R42.1 R44.2 R45.2 U39.7(GND) U40.4(GND) U41.4(GND)
CLK: U41.1(1CLK) ; port CLK
INT_ADC2: R46.2 ; port ADC0
NetC6_1: C6.1 R46.1 U39.4(COM2) U39.8(NO3)
NetD3_1: D3.1(A) ; port VCHARGE
NetD3_2: D3.2(C) U39.9(COM3)
NetR42_2: R42.2 U39.6(IN3) ; port EN_CHR_0
NetR43_2: R43.2 U40.2(1B) ; port EN_CAS_TIME_0
NetR44_1: R44.1 U39.3(NO2)
NetR45_1: R45.1 U39.1(NO1)
NetU20_5: U41.2(1D) ; port EN_TIME_0
NetU39_5: U39.5(IN2) U40.7(1Y)
NetU40_1: U40.1(1A) U41.7(1Q)

Not connected (* = marked no-connect by the designer): U39 2(COM1)* 10(COM4) 11(NO4)* 12(IN4)* 13(IN1)*

### Library data of the parts
C6 = CMP-1034-02089-3: as C47 on sheet HRT; Depth: 0.5mm; Dielectric: X7R; Min Operating Temperature: -55°C; Package Quantity: 1; Termination: SMD/SMT; Mount: Surface Mount; Radiation Hardening: No; Height: 0.5mm; Case Code (Metric): 1005; Packaging: Tape and Reel; Material: Ceramic; Voltage: 16V; Voltage Rating (DC): 16V; REACH SVHC: No SVHC; Voltage Rating: 16V; Length: 1mm; Tolerance: 10%; Thickness: 0.022inch; Case Code (Imperial): 0402; Max Operating Temperature: 125°C; Width: 0.02inch; Lead Free: Lead Free; Case/Package: 0402
C7 C8 C42 = CMP-2008-02046-2: as C44 on sheet CHRT; Package: C0402-BB; Temperature: -55°C to +125°C; ComponentLink2Description: Datasheet; Temperature Characteristic: X5R; Device Class L1: Passive Components; Height: 0.55mm; Lead Free: Yes; ComponentLink2URL: https://content.kemet.com/datasheets/KEM_C1002_X7R_SMD.pdf; Device Class L2: Capacitors; Temperature Range Low: -55°C; Temperature Range High: +125°C; RoHS: TRUE; Octopart: https://octopart.com/c0402c104k8pactu-kemet-140039; Automotive: No; Mouser Description: Capacitor 100 nF 10 VDC 0402; Category: Cap; Voltage Rating: 10 V; Digikey Description: CAP CER 0.1UF 10V X5R 0402; Ipc Land Pattern Name: CAPC10050X50; Device Class L3: Ceramic Capacitors; Manufacturer Part Number: C0402C104K8PACTU
D3 = CMP-02539-000026-1: as D1 on sheet CHRT; Temperature: to +125°C; Octopart: https://octopart.com/bas40-02v-v-g-08-vishay-44351221; Device Class L3: Schottky Diodes; RoHS: TRUE; Category: Diode; Digikey Description: DIODE SCHOTTKY 40V 120MA SOD523; Forward Current: 120mA; Automotive: No; Mouser Description: BAS40 Series 40 V 120 mA Surface Mount Small Signal Schottky Diode - SOD-523; Package: S8-V-3880.02-001; Device Class L2: Diodes; ComponentLink2URL: https://www.vishay.com/docs/82391/bas4002v.pdf; Temperature Range High: +125°C; Lead Free: Yes; Reverse Voltage: 40V; ComponentLink2Description: Datasheet; Height: 0.7mm; Max Repetitive Reverse Voltage: 40V; Device Class L1: Discrete Semiconductors
R42 R43 = CMP-1011-00170-3: as R30 on sheet CHRT; Case Code (Metric): 1005; Tolerance: 5%; Lead Free: Lead Free; Length: 1mm; Packaging: Tape and Reel; Depth: 0.5mm; Composition: Thick Film; Temperature Coefficient: 200ppm/°C; Package Quantity: 1; Radiation Hardening: No; Weight: 2.3E-05oz; Width: 0.5mm; Military Standard: Not; Power Rating: 63mW; Case/Package: 0402; Termination: SMD/SMT; Height: 0.016inch; Voltage Rating: 50V; Contact Plating: Tin; Number of Terminations: 2; Features: Automotive AEC-Q200; Max Operating Temperature: 155°C; Case Code (Imperial): 0402; Min Operating Temperature: -55°C
R44 R45 = CMP-2002-08382-1: Manufacturer: Vishay Dale; Part Number: CRCW040222R0FKED
R46 = CMP-2002-00605-3: as R29 on sheet CHRT; Width: 0.5 mm; Pins: 2; ComponentLink2Description: Datasheet; PackageReference: 0402; Height: 0.35 mm; Tolerance: 1%; DatasheetVersion: 04/2015; Case Code (Imperial): 0402; Min Operating Temperature: -55 degC; Radiation Hardening: No; Length: 1 mm; Package Quantity: 10000; PackageDescription: 2-Pin Surface Mount Device, Body 1 x 0.5 mm; Mounting Technology: Surface Mount; Case Code (Metric): 1005; Packaging: Tape and Reel; ComponentLink1URL: http://www.panasonic.com/; RoHSCompliant: true; Max Operating Temperature: 155 degC; REACH SVHC: Yes; PartNumber: ERJ-2RKF1000X; ComponentLink1Description: Manufacturer URL; ComponentLink2URL: http://industrial.panasonic.com/cdbs/www-data/pdf/RDA0000/AOA0000C86.pdf; Mount: Surface Mount
U39 = CMP-04892-000059-1: as U23 on sheet CHRT; Packaging: Tape and Reel; Contact Plating: Gold; Mount: Surface Mount; Low Level Output Current: 100mA; Termination: SMD/SMT; Min Operating Temperature: -40°C; Case/Package: TSSOP; REACH SVHC: No SVHC; Weight: 0.002018oz; Number of Pins: 14; Throw Configuration: SPST; Height: 1.05mm; Radiation Hardening: No; Length: 5.1mm; Max Operating Temperature: 85°C; Package Quantity: 1; Lead Free: Lead Free; RoHS Compliant: Yes; Number of Channels: 4; Number of Outputs: 4; Width: 4.5mm
U40 = CMP-0859-00590-3: as U25 on sheet HRT; Sub-Family: NAND Gate; Generic Part Number: SN74AUP2G00; PackageReference: DCU0008A; Schmitt Trigger: No; Input Type: CMOS; DatasheetVersion: SCES752C; Operating Temperature Range(C): -40 to 85
U41 = CMP-0859-00716-3: as U26 on sheet HRT; DatasheetVersion: SCES755C; Generic Part Number: SN74AUP2G79; Sub-Family: D-Type Flip-Flop; PackageReference: DCU0008A; Schmitt Trigger: No; Output Type: CMOS; Operating Temperature Range(C): -40 to 85

## Nets that join several sheets
CHRT_VIN: CHRT (C45.2 C46.2 D1.2 U23.14), HRT (8 pins), Cascade (5 pins), HRT1 (7 pins)
EH_VIN: TOP (R9.1), Power (12 pins), em_storage (13 pins), CHRT (U22.1 U22.4)
EH_VIN_SENSE: Power (J12.2 R7.2 U1.A1), Connectors (8 pins)
EM_VCC: Power (R6.1), em_storage (19 pins)
EM_VOUT: Power (R10.1), em_storage (C29.2 U15.3)
EM_VREF: Power (EM_VREF.1), em_storage (5 pins)
GND: TOP (5 pins), Sensors (23 pins), Power (42 pins), em_storage (32 pins), Connectors (76 pins), CHRT (7 pins), HRT (12 pins), Cascade (15 pins), HRT1 (10 pins)
MICRO_VCC: TOP (R25.2 U20.16), Sensors (C1.1 C61.1 U33.8 U42.8), Power (5 pins), Connectors (J1.2,74 R4.1), CHRT (D1.1)
SENSOR_VCC: Power (18 pins), Connectors (J3.2)
USB_VCC: Power (C11.1 P1.1 U3.1 U3.2), Connectors (5 pins)
VCC_1: Power (C13.1 U4.3), Connectors (J5.15 J5.16)
VCC_2: Power (C17.2 U6.3), Connectors (J5.17 J5.18)
VCC_3: Power (C21.2 U9.3), Connectors (J5.19 J5.20)
VCC_4: Power (C26.2 U11.3), Connectors (J10.15 J10.16)
VCC_5: Power (C14.2 U5.3), Connectors (J10.17 J10.18)
VCC_6: Power (C18.2 U7.3), Connectors (J10.19 J10.20)
VCC_7: Sensors (8 pins), Power (C22.2 U10.3)
VCC_8: Sensors (15 pins), Power (C27.2 U12.3)
ADC0: Connectors (J1.40), CHRT (U23.2)
ADC1: Connectors (J1.42), CHRT (U23.4)
ADC2: Connectors (J1.44), CHRT (U23.9)
AIN0: TOP (R9.2 R47.2), Connectors (J1.34 J5.8)
AIN5: Power (U1.B2), Connectors (J1.46)
CASCADE_EN: Connectors (J1.32 J9.14), Cascade (U28.2)
CC1: TOP (R26.2), Connectors (J6.12 J8.A5)
CC2: TOP (R27.2), Connectors (J6.13 J8.B5)
CLK: Connectors (J1.20), CHRT (R30.2), HRT (U26.1 U26.5), Cascade (U28.1), HRT1 (U41.1)
I2C0_SCL: Sensors (U42.1), Connectors (I2C0_SCL.1 J1.53 J4.12)
I2C0_SDA: em_storage (R13.2 U14.4), Connectors (I2C0_SDA.1 J1.51 J4.13)
I2C1_SCL: Sensors (U36.2 U37.2 U38.8), Connectors (5 pins)
I2C1_SDA: Sensors (U36.8 U37.8 U38.2), Connectors (5 pins)
INT_ADC0: CHRT (U23.1), HRT (R38.2), Cascade (U30.1)
INT_ADC1: CHRT (U23.3), HRT (R39.2), Cascade (U29.1)
INT_ADC2: CHRT (U23.8), HRT1 (R46.2)
LOAD_SER: TOP (U20.9), Power (U8.14)
NetD2_1: CHRT (R28.2), HRT (D2.1)
NetD3_1: CHRT (R29.2), HRT1 (D3.1)
NetR16_2: Power (VREF_RAW.1), em_storage (R16.2 R21.2 R22.2 U19.2)
NetR32_2: TOP (U20.3), HRT (R32.2 U24.12)
NetR33_2: TOP (U20.1), HRT (R33.2 U24.6)
NetR37_2: HRT (R37.2 U25.6), Cascade (U27.1)
NetR42_2: TOP (U20.4), HRT1 (R42.2 U39.6)
NetR43_2: Cascade (U27.3), HRT1 (R43.2 U40.2)
NetU20_2: TOP (U20.2), HRT (U26.6)
NetU20_5: TOP (U20.5), HRT1 (U41.2)
NetU20_15: TOP (U20.15), HRT (U26.2)
QSPI0_MISO: Sensors (U33.2 U42.2), Connectors (J1.62 J4.6 QSPI0_MISO.1)
QSPI0_MOSI: Sensors (U33.5 U42.5), em_storage (U14.3), Connectors (J1.64 J4.5 QSPI0_MOSI.1)
QSPI0_SCK: Sensors (U33.6 U42.6), em_storage (U14.2), Connectors (J1.60 J4.7 QSPI0_SCK.1)
QSPI0_SS0: Sensors (U33.1), Connectors (J1.70 J4.4 QSPI0_SS0.1)
RCLK: TOP (U20.12), Power (U8.12), Connectors (J1.35)
SHIFT_DATA: TOP (U20.14), Connectors (J1.22)
SRCLK: TOP (U20.11), Power (U8.11), Connectors (J1.37)
TMR3A_IOB: Connectors (J1.47 J9.15), CHRT (R31.1 U23.5 U23.6 U23.13)